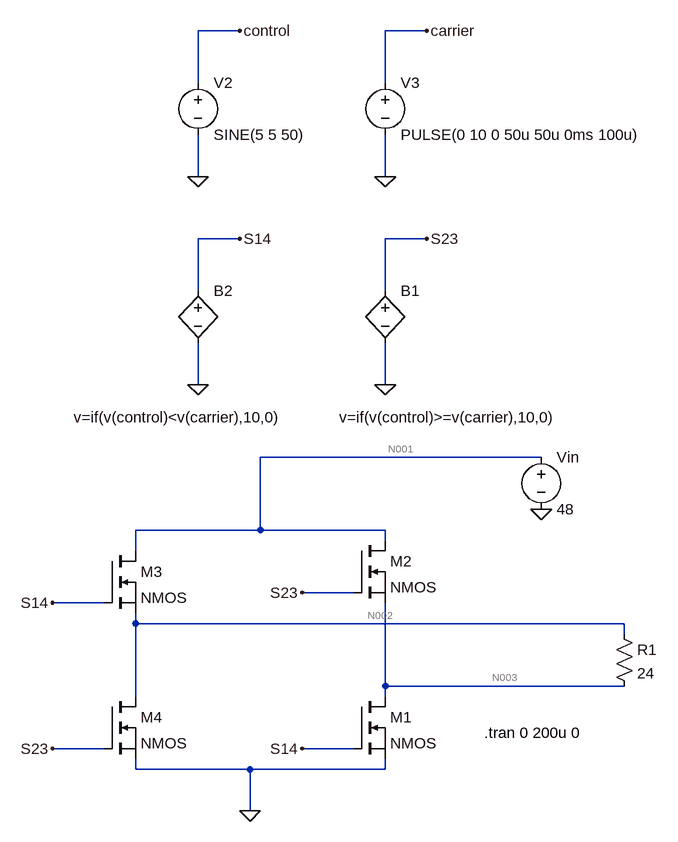
[diagram p0: schematic Draft4.asc]
Draft4.asc, the LTspice schematic file:
Version 4
SHEET 1 2076 900
WIRE 112 -880 48 -880
WIRE 400 -880 336 -880
WIRE 48 -800 48 -880
WIRE 336 -800 336 -880
WIRE 48 -656 48 -720
WIRE 336 -656 336 -720
WIRE 112 -560 48 -560
WIRE 400 -560 336 -560
WIRE 48 -480 48 -560
WIRE 336 -480 336 -560
WIRE 48 -336 48 -400
WIRE 336 -336 336 -400
WIRE 576 -224 144 -224
WIRE 144 -112 144 -224
WIRE 144 -112 -48 -112
WIRE 336 -112 144 -112
WIRE 336 -96 336 -112
WIRE -48 -80 -48 -112
WIRE 288 -16 208 -16
WIRE -96 0 -176 0
WIRE -48 32 -48 16
WIRE 704 32 -48 32
WIRE 704 48 704 32
WIRE 336 128 336 0
WIRE 704 128 336 128
WIRE -48 144 -48 32
WIRE 336 144 336 128
WIRE -96 224 -176 224
WIRE 288 224 208 224
WIRE -48 256 -48 240
WIRE 128 256 -48 256
WIRE 336 256 336 240
WIRE 336 256 128 256
WIRE 128 320 128 256
FLAG 128 320 0
FLAG 576 -144 0
FLAG -176 0 S14
FLAG 208 224 S14
FLAG 208 -16 S23
FLAG -176 224 S23
FLAG 48 -656 0
FLAG 112 -880 control
FLAG 48 -336 0
FLAG 112 -560 S14
FLAG 336 -336 0
FLAG 400 -560 S23
FLAG 336 -656 0
FLAG 400 -880 carrier
SYMBOL res 688 32 R0
SYMATTR InstName R1
SYMATTR Value 24
SYMBOL voltage 576 -240 R0
WINDOW 123 0 0 Left 0
WINDOW 39 0 0 Left 0
SYMATTR InstName Vin
SYMATTR Value 48
SYMBOL voltage 48 -816 R0
WINDOW 123 0 0 Left 0
WINDOW 39 0 0 Left 0
SYMATTR InstName V2
SYMATTR Value SINE(5 5 50)
SYMBOL bv 336 -496 R0
WINDOW 3 -71 210 Left 2
SYMATTR Value v=if(v(control)>=v(carrier),10,0)
SYMATTR InstName B1
SYMBOL bv 48 -496 R0
WINDOW 3 -191 210 Left 2
SYMATTR Value v=if(v(control)<v(carrier),10,0)
SYMATTR InstName B2
SYMBOL voltage 336 -816 R0
WINDOW 123 0 0 Left 0
WINDOW 39 0 0 Left 0
SYMATTR InstName V3
SYMATTR Value PULSE(0 10 0 50u 50u 0ms 100u)
SYMBOL nmos 288 144 R0
SYMATTR InstName M1
SYMBOL nmos 288 -96 R0
SYMATTR InstName M2
SYMBOL nmos -96 -80 R0
SYMATTR InstName M3
SYMBOL nmos -96 144 R0
SYMATTR InstName M4
TEXT 488 200 Left 2 !.tran 0 200u 0

The netlist it stands for:
* Draft4.asc
R1 N002 N003 24
Vin N001 0 48
V2 control 0 SINE(5 5 50)
B1 S23 0 v=if(v(control)>=v(carrier),10,0)
B2 S14 0 v=if(v(control)<v(carrier),10,0)
V3 carrier 0 PULSE(0 10 0 50u 50u 0ms 100u)
M1 N003 S14 0 0 NMOS
M2 N001 S23 N003 N003 NMOS
M3 N001 S14 N002 N002 NMOS
M4 N002 S23 0 0 NMOS
.model NMOS NMOS
.model PMOS PMOS
.lib standard.mos
.tran 0 200u 0
.backanno
.end

* Results of the author's LTspice run, read from the files saved beside the schematic
* Operating Point, zero values left out:
*   V(n002) = 2.923 V
*   V(n003) = 2.935 V
*   V(n001) = 48 V
*   V(control) = 5 V
*   V(s23) = 10 V
*   Id(M4) = 499.2 µA
*   Ib(M4) = -2.933 pA
*   Is(M4) = -499.2 µA
*   Id(M3) = 90.16 pA
*   Ib(M3) = -45.09 pA
*   Is(M3) = -45.08 pA
*   Id(M2) = 499.2 µA
*   Ib(M2) = -45.08 pA
*   Is(M2) = -499.2 µA
*   Id(M1) = 5.88 pA
*   Ib(M1) = -2.945 pA
*   Is(M1) = -2.935 pA
*   I(R1) = -499.2 µA
*   I(Vin) = -499.2 µA
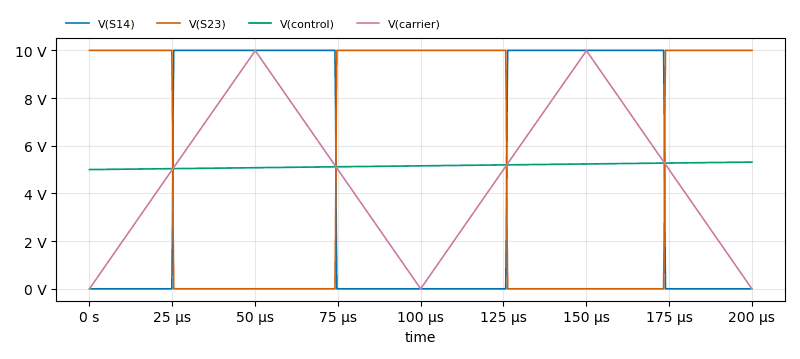
[diagram p1: Transient Analysis of Draft4.asc, plotted from the saved traces]
* Transient Analysis, 1 run:
*   V(S14): min 0 V, max 10 V, average 4.846 V, rms 6.951 V, last 0 V
*   V(S23): min 0 V, max 10 V, average 5.154 V, rms 7.169 V, last 10 V
*   V(control): min 5 V, max 5.314 V, average 5.157 V, rms 5.158 V, last 5.314 V
*   V(carrier): min 0 V, max 9.988 V, average 4.997 V, rms 6.072 V, last 0 V